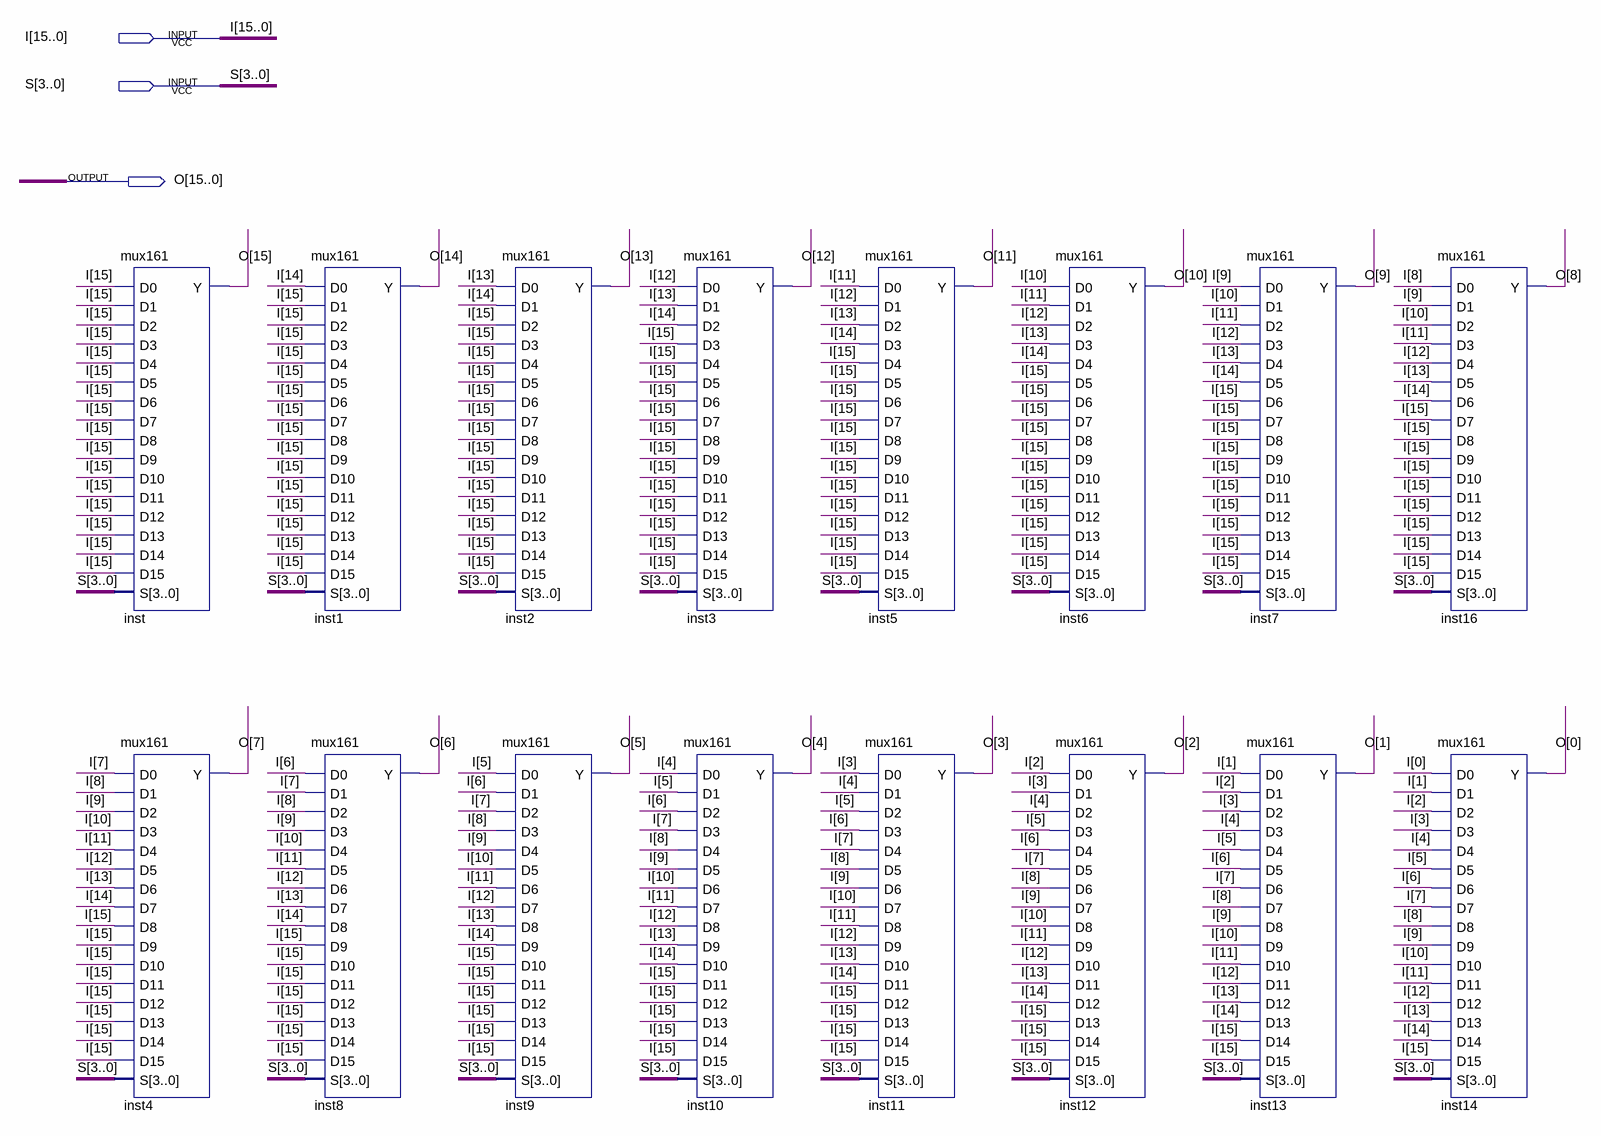
[diagram p0: schematic sheet]
// Quartus schematic Shift_Right.bdf as structural Verilog: 16 symbols, 3 pins
module Shift_Right (
  input  [15:0] I,
  input  [3:0] S,
  output [15:0] O
);

  mux161 inst (
    .D0(I[15]), .D1(I[15]), .D2(I[15]), .D3(I[15]), .D4(I[15]), .D5(I[15]), .D6(I[15]), .D7(I[15]),
    .D8(I[15]), .D9(I[15]), .D10(I[15]), .D11(I[15]), .D12(I[15]), .D13(I[15]), .D14(I[15]), .D15(I[15]),
    .S(S), .Y(O[15]));
  mux161 inst4 (
    .D0(I[7]), .D1(I[8]), .D2(I[9]), .D3(I[10]), .D4(I[11]), .D5(I[12]), .D6(I[13]), .D7(I[14]), .D8(I[15]),
    .D9(I[15]), .D10(I[15]), .D11(I[15]), .D12(I[15]), .D13(I[15]), .D14(I[15]), .D15(I[15]), .S(S), .Y(O[7]));
  mux161 inst1 (
    .D0(I[14]), .D1(I[15]), .D2(I[15]), .D3(I[15]), .D4(I[15]), .D5(I[15]), .D6(I[15]), .D7(I[15]),
    .D8(I[15]), .D9(I[15]), .D10(I[15]), .D11(I[15]), .D12(I[15]), .D13(I[15]), .D14(I[15]), .D15(I[15]),
    .S(S), .Y(O[14]));
  mux161 inst8 (
    .D0(I[6]), .D1(I[7]), .D2(I[8]), .D3(I[9]), .D4(I[10]), .D5(I[11]), .D6(I[12]), .D7(I[13]), .D8(I[14]),
    .D9(I[15]), .D10(I[15]), .D11(I[15]), .D12(I[15]), .D13(I[15]), .D14(I[15]), .D15(I[15]), .S(S), .Y(O[6]));
  mux161 inst2 (
    .D0(I[13]), .D1(I[14]), .D2(I[15]), .D3(I[15]), .D4(I[15]), .D5(I[15]), .D6(I[15]), .D7(I[15]),
    .D8(I[15]), .D9(I[15]), .D10(I[15]), .D11(I[15]), .D12(I[15]), .D13(I[15]), .D14(I[15]), .D15(I[15]),
    .S(S), .Y(O[13]));
  mux161 inst9 (
    .D0(I[5]), .D1(I[6]), .D2(I[7]), .D3(I[8]), .D4(I[9]), .D5(I[10]), .D6(I[11]), .D7(I[12]), .D8(I[13]),
    .D9(I[14]), .D10(I[15]), .D11(I[15]), .D12(I[15]), .D13(I[15]), .D14(I[15]), .D15(I[15]), .S(S), .Y(O[5]));
  mux161 inst3 (
    .D0(I[12]), .D1(I[13]), .D2(I[14]), .D3(I[15]), .D4(I[15]), .D5(I[15]), .D6(I[15]), .D7(I[15]),
    .D8(I[15]), .D9(I[15]), .D10(I[15]), .D11(I[15]), .D12(I[15]), .D13(I[15]), .D14(I[15]), .D15(I[15]),
    .S(S), .Y(O[12]));
  mux161 inst10 (
    .D0(I[4]), .D1(I[5]), .D2(I[6]), .D3(I[7]), .D4(I[8]), .D5(I[9]), .D6(I[10]), .D7(I[11]), .D8(I[12]),
    .D9(I[13]), .D10(I[14]), .D11(I[15]), .D12(I[15]), .D13(I[15]), .D14(I[15]), .D15(I[15]), .S(S), .Y(O[4]));
  mux161 inst5 (
    .D0(I[11]), .D1(I[12]), .D2(I[13]), .D3(I[14]), .D4(I[15]), .D5(I[15]), .D6(I[15]), .D7(I[15]),
    .D8(I[15]), .D9(I[15]), .D10(I[15]), .D11(I[15]), .D12(I[15]), .D13(I[15]), .D14(I[15]), .D15(I[15]),
    .S(S), .Y(O[11]));
  mux161 inst11 (
    .D0(I[3]), .D1(I[4]), .D2(I[5]), .D3(I[6]), .D4(I[7]), .D5(I[8]), .D6(I[9]), .D7(I[10]), .D8(I[11]),
    .D9(I[12]), .D10(I[13]), .D11(I[14]), .D12(I[15]), .D13(I[15]), .D14(I[15]), .D15(I[15]), .S(S), .Y(O[3]));
  mux161 inst6 (
    .D0(I[10]), .D1(I[11]), .D2(I[12]), .D3(I[13]), .D4(I[14]), .D5(I[15]), .D6(I[15]), .D7(I[15]),
    .D8(I[15]), .D9(I[15]), .D10(I[15]), .D11(I[15]), .D12(I[15]), .D13(I[15]), .D14(I[15]), .D15(I[15]),
    .S(S), .Y(O[10]));
  mux161 inst12 (
    .D0(I[2]), .D1(I[3]), .D2(I[4]), .D3(I[5]), .D4(I[6]), .D5(I[7]), .D6(I[8]), .D7(I[9]), .D8(I[10]),
    .D9(I[11]), .D10(I[12]), .D11(I[13]), .D12(I[14]), .D13(I[15]), .D14(I[15]), .D15(I[15]), .S(S), .Y(O[2]));
  mux161 inst7 (
    .D0(I[9]), .D1(I[10]), .D2(I[11]), .D3(I[12]), .D4(I[13]), .D5(I[14]), .D6(I[15]), .D7(I[15]),
    .D8(I[15]), .D9(I[15]), .D10(I[15]), .D11(I[15]), .D12(I[15]), .D13(I[15]), .D14(I[15]), .D15(I[15]),
    .S(S), .Y(O[9]));
  mux161 inst13 (
    .D0(I[1]), .D1(I[2]), .D2(I[3]), .D3(I[4]), .D4(I[5]), .D5(I[6]), .D6(I[7]), .D7(I[8]), .D8(I[9]),
    .D9(I[10]), .D10(I[11]), .D11(I[12]), .D12(I[13]), .D13(I[14]), .D14(I[15]), .D15(I[15]), .S(S), .Y(O[1]));
  mux161 inst16 (
    .D0(I[8]), .D1(I[9]), .D2(I[10]), .D3(I[11]), .D4(I[12]), .D5(I[13]), .D6(I[14]), .D7(I[15]), .D8(I[15]),
    .D9(I[15]), .D10(I[15]), .D11(I[15]), .D12(I[15]), .D13(I[15]), .D14(I[15]), .D15(I[15]), .S(S), .Y(O[8]));
  mux161 inst14 (
    .D0(I[0]), .D1(I[1]), .D2(I[2]), .D3(I[3]), .D4(I[4]), .D5(I[5]), .D6(I[6]), .D7(I[7]), .D8(I[8]),
    .D9(I[9]), .D10(I[10]), .D11(I[11]), .D12(I[12]), .D13(I[13]), .D14(I[14]), .D15(I[15]), .S(S), .Y(O[0]));
endmodule
